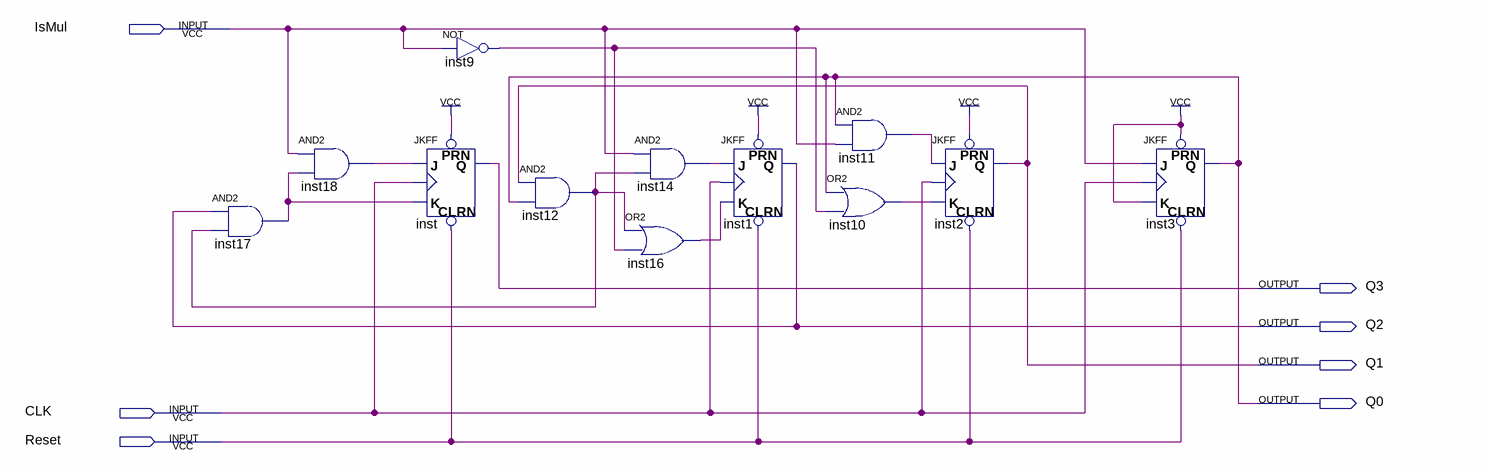
[diagram p0: schematic sheet]
// Quartus schematic counter.bdf as structural Verilog: 12 symbols, 7 pins
module counter (
  input  IsMul,
  input  CLK,
  input  Reset,
  output Q3,
  output Q2,
  output Q1,
  output Q0
);

  wire inst9_out, inst10_out, inst11_out, inst12_out, inst14_out, inst16_out, inst17_out, inst18_out;

  and inst17 (inst17_out, Q2, inst12_out);
  and inst18 (inst18_out, IsMul, inst17_out);
  not inst9 (inst9_out, IsMul);
  JKFF inst (.PRN(1'b1), .CLRN(Reset), .K(inst17_out), .J(inst18_out), .CLK(CLK), .Q(Q3));
  and inst12 (inst12_out, Q1, Q0);
  and inst14 (inst14_out, IsMul, inst12_out);
  or inst16 (inst16_out, inst12_out, inst9_out);
  JKFF inst1 (.PRN(1'b1), .CLRN(Reset), .K(inst16_out), .J(inst14_out), .CLK(CLK), .Q(Q2));
  and inst11 (inst11_out, Q0, IsMul);
  or inst10 (inst10_out, Q0, inst9_out);
  JKFF inst2 (.PRN(1'b1), .CLRN(Reset), .K(inst10_out), .J(inst11_out), .CLK(CLK), .Q(Q1));
  JKFF inst3 (.PRN(1'b1), .CLRN(Reset), .K(1'b1), .J(IsMul), .CLK(CLK), .Q(Q0));
endmodule
